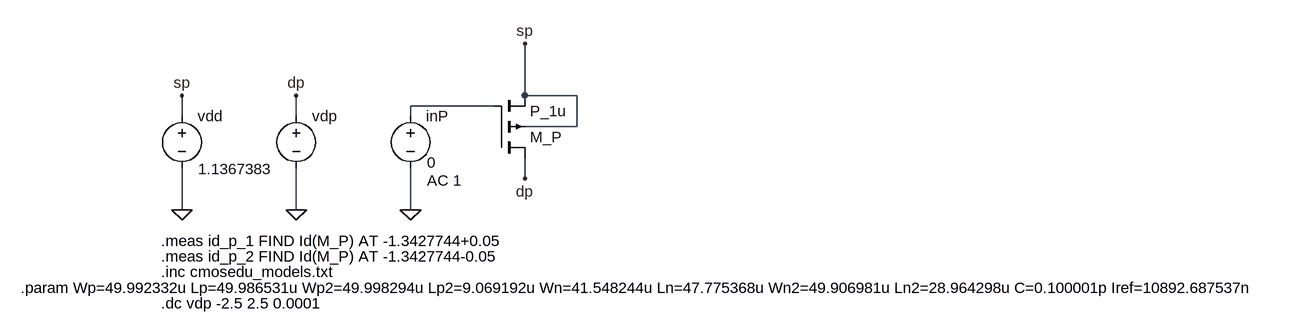
[diagram p0: schematic R2.asc]
R2.asc, the LTspice schematic file:
Version 4
SHEET 1 1932 680
WIRE 512 -48 512 -128
WIRE 592 -48 512 -48
WIRE 464 -32 336 -32
WIRE -16 -16 -16 -48
WIRE 160 -16 160 -48
WIRE 336 -16 336 -32
WIRE 592 0 592 -48
WIRE 592 0 512 0
WIRE 512 80 512 48
WIRE -16 128 -16 64
WIRE 160 128 160 64
WIRE 336 128 336 64
FLAG 512 -128 sp
FLAG 336 128 0
FLAG 160 128 0
FLAG 160 -48 dp
FLAG 512 80 dp
FLAG -16 128 0
FLAG -16 -48 sp
SYMBOL pmos4 464 48 M180
SYMATTR InstName M_P
SYMATTR Value P_1u
SYMATTR Value2 l={Lp2} w={Wp2}
SYMBOL voltage 336 -32 R0
WINDOW 3 25 87 Left 2
WINDOW 123 25 115 Left 2
WINDOW 39 0 0 Left 2
SYMATTR Value 0
SYMATTR Value2 AC 1
SYMATTR InstName inP
SYMBOL voltage 160 -32 R0
WINDOW 123 0 0 Left 2
WINDOW 39 0 0 Left 2
WINDOW 3 24 44 Left 2
SYMATTR Value ""
SYMATTR InstName vdp
SYMBOL voltage -16 -32 R0
WINDOW 123 0 0 Left 2
WINDOW 39 0 0 Left 2
WINDOW 3 25 97 Left 2
SYMATTR Value 1.1367383
SYMATTR InstName vdd
TEXT -48 224 Left 2 !.inc cmosedu_models.txt
TEXT -48 272 Left 2 !.dc vdp -2.5 2.5 0.0001
TEXT -48 176 Left 2 !.meas id_p_1 FIND Id(M_P) AT -1.3427744+0.05
TEXT -48 200 Left 2 !.meas id_p_2 FIND Id(M_P) AT -1.3427744-0.05
TEXT -264 248 Left 2 !.param Wp=49.992332u Lp=49.986531u Wp2=49.998294u Lp2=9.069192u Wn=41.548244u Ln=47.775368u Wn2=49.906981u Ln2=28.964298u C=0.100001p Iref=10892.687537n

The netlist it stands for:
* R2.asc
M_P dp N001 sp sp P_1u l={Lp2} w={Wp2}
V§inP N001 0 0 AC 1
vdp dp 0
vdd sp 0 1.1367383
.model NMOS NMOS
.model PMOS PMOS
.lib standard.mos
.inc cmosedu_models.txt
.dc vdp -2.5 2.5 0.0001
.meas id_p_1 FIND Id(M_P) AT -1.3427744+0.05
.meas id_p_2 FIND Id(M_P) AT -1.3427744-0.05
.param Wp=49.992332u Lp=49.986531u Wp2=49.998294u Lp2=9.069192u Wn=41.548244u Ln=47.775368u Wn2=49.906981u Ln2=28.964298u C=0.100001p Iref=10892.687537n
.backanno
.end